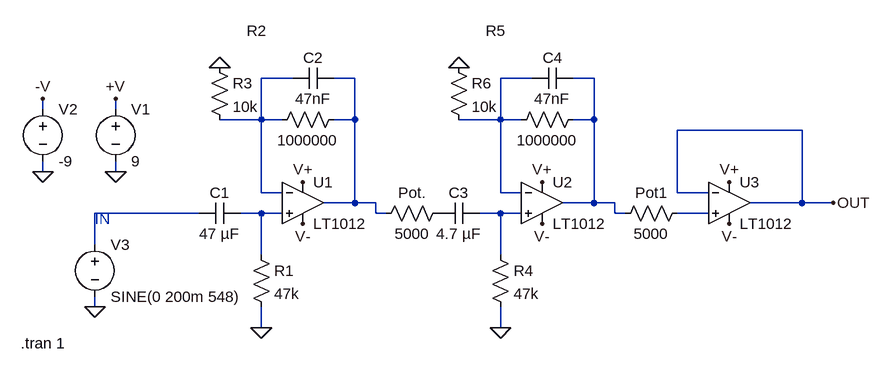
[diagram p0: schematic filter_model.asc]
filter_model.asc, the LTspice schematic file:
Version 4
SHEET 1 924 680
WIRE 16 -16 -32 -16
WIRE 112 -16 80 -16
WIRE 384 -16 336 -16
WIRE 480 -16 448 -16
WIRE -368 32 -368 16
WIRE -256 32 -256 16
WIRE -32 48 -32 -16
WIRE -32 48 -96 48
WIRE 0 48 -32 48
WIRE 112 48 112 -16
WIRE 112 48 80 48
WIRE 336 48 336 -16
WIRE 336 48 272 48
WIRE 368 48 336 48
WIRE 480 48 480 -16
WIRE 480 48 448 48
WIRE 800 64 608 64
WIRE -368 128 -368 112
WIRE -256 128 -256 112
WIRE -32 160 -32 48
WIRE 0 160 -32 160
WIRE 336 160 336 48
WIRE 368 160 336 160
WIRE 608 160 608 64
WIRE 656 160 608 160
WIRE 112 176 112 48
WIRE 112 176 64 176
WIRE 144 176 112 176
WIRE 480 176 480 48
WIRE 480 176 432 176
WIRE 512 176 480 176
WIRE 800 176 800 64
WIRE 800 176 720 176
WIRE 848 176 800 176
WIRE -128 192 -288 192
WIRE -32 192 -64 192
WIRE 0 192 -32 192
WIRE 144 192 144 176
WIRE 160 192 144 192
WIRE 336 192 304 192
WIRE 368 192 336 192
WIRE 512 192 512 176
WIRE 528 192 512 192
WIRE 656 192 608 192
WIRE -288 240 -288 192
WIRE -32 256 -32 192
WIRE 336 256 336 192
WIRE -288 336 -288 320
WIRE -32 368 -32 336
WIRE 336 368 336 336
FLAG 32 144 V+
FLAG 688 144 V+
FLAG 688 208 V-
FLAG 32 208 V-
FLAG -256 128 0
FLAG -256 16 +V
FLAG -368 128 0
FLAG -368 16 -V
FLAG -32 368 0
FLAG -96 -32 0
FLAG 848 176 OUT
FLAG -288 336 0
FLAG 400 144 V+
FLAG 400 208 V-
FLAG 336 368 0
FLAG 272 -32 0
SYMBOL Opamps\\LT1012 32 112 R0
SYMATTR InstName U1
SYMBOL Opamps\\LT1012 688 112 R0
SYMATTR InstName U3
SYMBOL cap -64 176 R90
WINDOW 0 0 32 VBottom 2
WINDOW 3 32 32 VTop 2
SYMATTR InstName C1
SYMATTR Value 47 µF
SYMBOL res -48 240 R0
SYMATTR InstName R1
SYMATTR Value 47k
SYMBOL voltage -256 16 R0
WINDOW 123 0 0 Left 2
WINDOW 39 0 0 Left 2
SYMATTR InstName V1
SYMATTR Value 9
SYMBOL voltage -368 16 R0
WINDOW 123 0 0 Left 2
WINDOW 39 0 0 Left 2
SYMATTR InstName V2
SYMATTR Value -9
SYMBOL cap 80 -32 R90
WINDOW 0 0 32 VBottom 2
WINDOW 3 32 32 VTop 2
SYMATTR InstName C2
SYMATTR Value 47nF
SYMBOL res 96 32 R90
WINDOW 0 -105 135 VBottom 2
WINDOW 3 32 56 VTop 2
SYMATTR InstName R2
SYMATTR Value 1000000
SYMBOL res -112 -48 R0
SYMATTR InstName R3
SYMATTR Value 10k
SYMBOL res 256 176 R90
WINDOW 0 0 56 VBottom 2
WINDOW 3 32 56 VTop 2
SYMATTR InstName Pot.
SYMATTR Value 5000
SYMBOL voltage -288 224 R0
WINDOW 123 0 0 Left 2
WINDOW 39 0 0 Left 2
SYMATTR InstName V3
SYMATTR Value SINE(0 200m 548)
SYMBOL Opamps\\LT1012 400 112 R0
SYMATTR InstName U2
SYMBOL cap 304 176 R90
WINDOW 0 0 32 VBottom 2
WINDOW 3 32 32 VTop 2
SYMATTR InstName C3
SYMATTR Value 4.7 µF
SYMBOL res 320 240 R0
SYMATTR InstName R4
SYMATTR Value 47k
SYMBOL cap 448 -32 R90
WINDOW 0 0 32 VBottom 2
WINDOW 3 32 32 VTop 2
SYMATTR InstName C4
SYMATTR Value 47nF
SYMBOL res 464 32 R90
WINDOW 0 -105 135 VBottom 2
WINDOW 3 32 56 VTop 2
SYMATTR InstName R5
SYMATTR Value 1000000
SYMBOL res 256 -48 R0
SYMATTR InstName R6
SYMATTR Value 10k
SYMBOL res 624 176 R90
WINDOW 0 0 56 VBottom 2
WINDOW 3 32 56 VTop 2
SYMATTR InstName Pot1
SYMATTR Value 5000
TEXT -288 200 Left 2 ;IN
TEXT -402 392 Left 2 !.tran 1

The netlist it stands for:
* filter_model.asc
XU1 N006 N001 V+ V- N002 LT1012  ; pins In+ In- V+ V- OUT
XU3 N008 OUT V+ V- OUT LT1012  ; pins In+ In- V+ V- OUT
C1 N006 N005 47 µF
R1 N006 0 47k
V1 +V 0 9
V2 -V 0 -9
C2 N002 N001 47nF
R2 N002 N001 1000000
R3 0 N001 10k
R§Pot. P001 N002 5000
V3 N005 0 SINE(0 200m 548)
XU2 N007 N003 V+ V- N004 LT1012  ; pins In+ In- V+ V- OUT
C3 N007 P001 4.7 µF
R4 N007 0 47k
C4 N004 N003 47nF
R5 N004 N003 1000000
R6 0 N003 10k
R§Pot1 N008 N004 5000
* IN
.tran 1
.backanno
.end